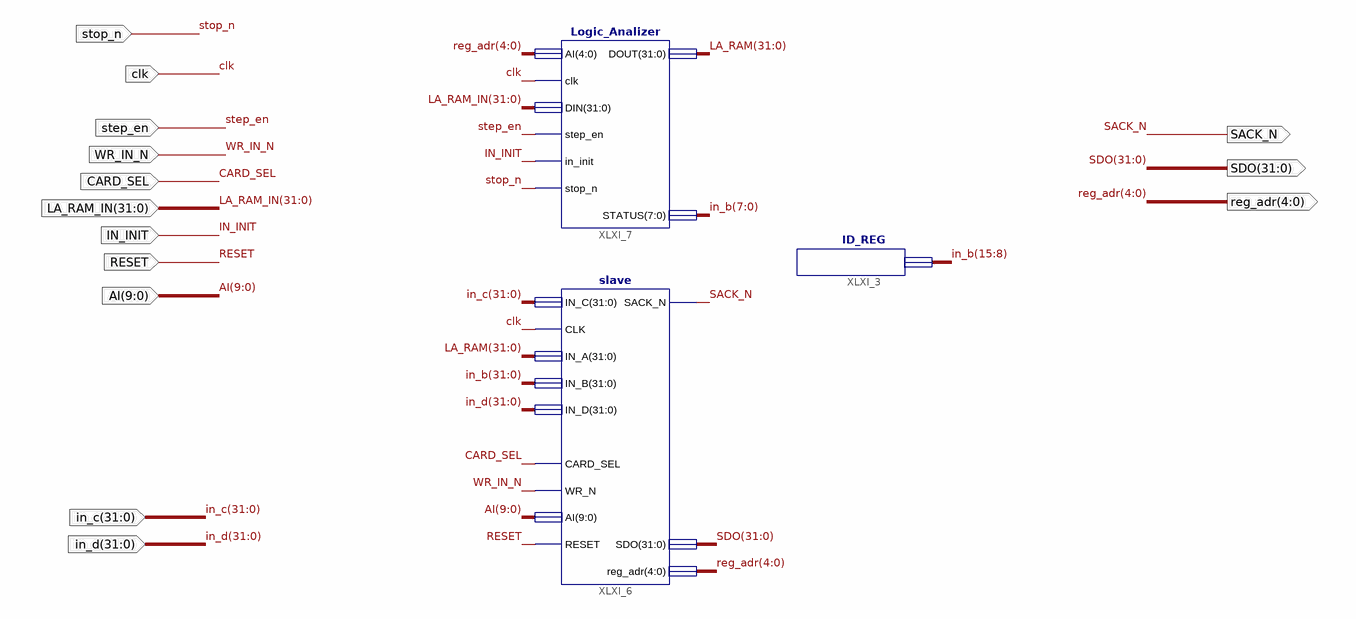
[diagram p0: schematic sheet 1]
// Xilinx ISE schematic Monitor.sch (spartan6) as structural Verilog: 3 symbols, 14 ports
module Monitor (
  input  clk,
  input  stop_n,
  input  [9:0] AI,
  input  CARD_SEL,
  input  [31:0] in_c,
  input  [31:0] in_d,
  input  step_en,
  input  WR_IN_N,
  input  [31:0] LA_RAM_IN,
  input  IN_INIT,
  input  RESET,
  output SACK_N,
  output [4:0] reg_adr,
  output [31:0] SDO
);

  wire [31:0] in_b, LA_RAM;

  ID_REG XLXI_3 (.ID_OUT(in_b[15:8]));
  slave XLXI_6 (
    .IN_C(in_c), .CLK(clk), .IN_A(LA_RAM), .IN_B(in_b), .IN_D(in_d), .CARD_SEL(CARD_SEL), .WR_N(WR_IN_N),
    .RESET(RESET), .AI(AI), .SACK_N(SACK_N), .SDO(SDO), .reg_adr(reg_adr));
  Logic_Analizer XLXI_7 (
    .AI(reg_adr), .clk(clk), .DIN(LA_RAM_IN), .step_en(step_en), .in_init(IN_INIT), .stop_n(stop_n),
    .DOUT(LA_RAM), .STATUS(in_b[7:0]));
endmodule
